# Altium project Woobly.PrjPcb
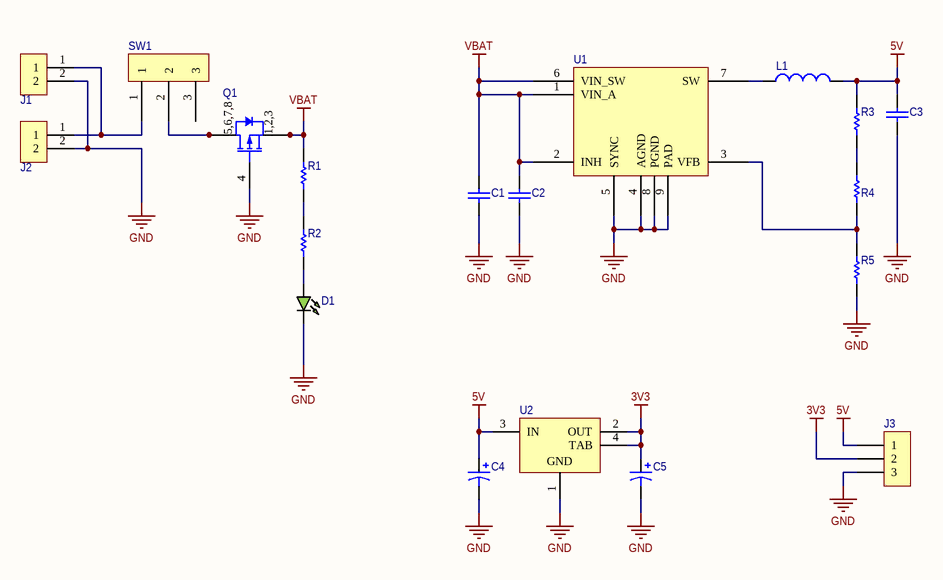
[diagram p0: Power regulators.SchDoc]
3 sheets, 82 parts. Net scope: flat (ports and power ports of the same name join across sheets).
Sheets:
  Power regulators.SchDoc
  Microcontroller and UI.SchDoc
  Peripherals connectors.SchDoc

## Sheet Power regulators.SchDoc
size A; SheetNumber: 1

### Parts
C1  Kemet C1206C475K3RACAUTO  [CAPC3216X180X50ML20T25]  (value not drawn)
C2  Kemet C1206C104K5RACAUTO  [CAPC3216X88X50ML20T25]  (value not drawn)
C3  Kemet C1210C226K4PAC7800  [CAPC3225X205X50ML20T25]  (value not drawn)
C4  Cap Pol2  [PCB-2utroa4rb2vd9is4ckmk-1]  (value not drawn)
C5  Cap Pol2  [PCB-2utroa4rb2vd9is4ckmk-1]  (value not drawn)
D1  LTST-C170KGKT  [CHIPLED  0805]  (value not drawn)
J1  TE   647676-2  [PCB-kypnbpwjlxn1m6lvhwgg-1]  (value not drawn)
J2  TE   647676-2  [PCB-kypnbpwjlxn1m6lvhwgg-1]  (value not drawn)
J3  Molex 75757-0431  [Molex 75757-0431]  (value not drawn)
L1  RLF7030T-3R3M4R1  [INDC7922X32N]  (value not drawn)
Q1  SYM-000bc976ee97dfcc-1  [PCB-o8kpmntap7p5mqdjohts-1]  (value not drawn)
R1  Vishay Dale CRCW12061K00FKEB  [RESC3216X60X45ML10T20]  (value not drawn)
R2  Vishay Dale CRCW12061K00FKEB  [RESC3216X60X45ML10T20]  (value not drawn)
R3  Vishay CRCW1206100KFKEA  [PCB-76kjjvsvnrmyxpejc0rn-1]  (value not drawn)
R4  Vishay Dale CRCW12065K10FKEA  [RESC3216X60X45ML10T20]  (value not drawn)
R5  Vishay Dale CRCW120620K0FKTA  [RESC3216X60X45ML10T20]  (value not drawn)
SW1  Canal Components SL19-121  [PCB-btjqrve0936pn890qe86-1]  (value not drawn)
U1  ST1S10  [PCB-q7tc9tlrfg8r6x64pd1q-1]  (value not drawn)
U2  LM1117IMPX-3.3/NOPB  [MP04A_N]  (value not drawn)

### Nets
3V3: C5.1 J3.2 U2.2(OUT) U2.4(TAB)
5V: C3.1 C4.1 J3.1 L1.2 R3.2 U2.3(IN)
GND: C1.2 C2.2 C3.2 C4.2 C5.2 D1.1(K) J1.2 J2.2 J3.3 Q1.4(G) R5.2 U1.4(AGND) U1.5(SYNC) U1.8(PGND) U1.9(PAD) U2.1(GND)
VBAT: C1.1 C2.1 Q1.1(S) Q1.2(S) Q1.3(S) R1.1 U1.1(VIN_A) U1.2(INH) U1.6(VIN_SW)
NetD1_2: D1.2(A) R2.2
NetJ1_1: J1.1 J2.1 SW1.1
NetL1_1: L1.1 U1.7(SW)
NetQ1_5: Q1.5(D) Q1.6(D) Q1.7(D) Q1.8(D) SW1.2
NetR1_2: R1.2 R2.1
NetR3_1: R3.1 R4.2
NetR4_1: R4.1 R5.1 U1.3(VFB)

Not connected (* = marked no-connect by the designer): SW1 3

### Notes on the sheet
- (in symbol FDS4141) 5,6,7,8; 1,2,3

### Library data of the parts
C1 = C1206C475K3RACAUTO: CAPACITOR, 1206, X7R, 25V, 4.7UF; Capacitance: 4.7e-06 F; Capacitance Tolerance: ±10%; Dielectric Material: Ceramic; Lead-Free Status: R; Voltage Rating (DC): 25.0 V; Case/Package: 1206; Dielectric Characteristic: X7R; Mounting Style: Surface Mount; Octopart Url: https://octopart.com/c1206c475k3racauto-kemet-17603066; OctopartID: 7b3fb339c7a3a4f8; Packaging: Cut Tape (CT); REACH SVHC Compliance: No SVHC; RoHS: Compliant; Manufacturer Part Number: C1206C475K3RACAUTO
C2 = C1206C104K5RACAUTO: Cap Ceramic 0.1uF 50V X7R 10% SMD 1206 125C Plastic T/R; Capacitance: 1e-07 F; Lead-Free Status: R; Voltage Rating (DC): 50.0 V; Manufacturer Part Number: C1206C104K5RACAUTO; Capacitance Tolerance: ±10%; Case/Package: 1206; Dielectric Characteristic: X7R; Dielectric Material: Ceramic; Mounting Style: Surface Mount; Octopart Url: https://octopart.com/c1206c104k5racauto-kemet-12595586; OctopartID: 2beee2243f0af429; Packaging: Cut Tape (CT); REACH SVHC Compliance: No SVHC; RoHS: Compliant
C3 = C1210C226K4PACTU: Capacitor 1210 22uF 16V; Capacitance: 2.2e-05 F; Capacitance Tolerance: ±10%; Dielectric Characteristic: X5R; Dielectric Material: Ceramic; Lead-Free Status: Lead Free; Voltage Rating (DC): 16.0 V; Manufacturer Part Number: C1210C226K4PACTU; Case/Package: 1210; Mounting Style: Surface Mount; Octopart Url: https://octopart.com/c1210c226k4pac7800-kemet-11809228; OctopartID: aef0674eba5a7137; RoHS: Compliant
C4 C5 = T491C106K016AT4153: Cap Tant 10UF 10% 16V 2312
D1 = LTST-C170KGKT: Green 2 x 1.25 x 1.1 mm 130° Water Clear 35 mcd 2 V Surface Mount LED; Manufacturer: Lite-On; Case/Package (SI): 2012; Forward Voltage: 2.00 V; Lead-Free Status: Lead Free; Luminous Intensity: 35.0 mcd; Case/Package: 0805; Viewing Angle: 130 °; OctopartID: 4cca85c80a58930d; Manufacturer Part Number: LTST-C170KGKT; Size-Length: 2.00 mm; Size-Width: 1.25 mm; Octopart URL: https://octopart.com/ltst-c170kgkt-lite-on-549876
J1 J2 = 15EDGRC-3.5-02P-14: Pluggable terminal block; Colour: green; Mat: PA66; on PCBs; male; Contact Plating: Tin; Orientation: Right Angle; Manufacturer Part Number: 15EDGRC-3.5-02P-14; Flammability Rating: UL 94 V-0; Contact Material: Brass
J3 = CMP-6ec4a6b2c126b103-1: Conn Unshrouded Header HDR 3 POS 3.5mm Solder ST Thru-Hole Tube; Current Rating: 16.0 A; Glow Wire Compliant: Non-Compliant; Number of Circuits: 3; Mounting Style: Through Hole; Orientation: Vertical; Octopart URL: http://octopart.com/75757-0431-molex-24939140; Lifecycle Status: Active; Halogen Free Status: Low Halogen; OctopartID: 6ec4a6b2c126b103
L1 = RLF7030T-3R3M4R1: Inductor Power Shielded Wirewound 3.3uH 20% 100KHz Ferrite 4.1A 20.88mOhm DCR T/R; Inductance: 3.30 µH; Manufacturer Part Number: RLF7030T-3R3M4R1; Packaging: Tape & Reel (TR), Cut Tape (CT); Size-Width: 6.80 mm; Size-Length: 7.30 mm
Q1 = FDS4141: P-Channel 40 V 13 mOhm SMT PowerTrench® Mosfet - SOIC-8; Manufacturer Part Number: FDS4141
R1 R2 = CRCW12061K00FKEB: Thick Film Resistors - SMD 1/4watt 1Kohms 1%; Lead-Free Status: Lead Free; Power Rating: 0.25 W; Resistance: 1000.0 Ω; Voltage Rating (DC): 200.0 V; Case/Package: 1206; Number of Pins: 2; Octopart Url: https://octopart.com/crcw12061k00fkeb-vishay+dale-42466336; OctopartID: 6554aed9bc12ba93; Resistance Tolerance: ±1%; RoHS: Compliant; Manufacturer Part Number: CRCW12061K00FKEB
R3 = CRCW1206100KFKEA: Res Thick Film 1206 100K Ohm 1% 1/4W ±100ppm/°C Molded SMD SMD Paper T/R
R4 = CRCW12065K10FKEA: RES SMD 5.1K OHM 1% 1/4W 1206; Case/Package (SI): 3216; Lead-Free Status: Lead Free; Power Rating: 0.25 W; Resistance: 5100.0 Ω; Voltage Rating (DC): 200.0 V; Manufacturer Part Number: CRCW12065K10FKEA; Case/Package: 1206; Mounting Style: Surface Mount; Number of Pins: 2; Octopart Url: https://octopart.com/crcw12065k10fkea-vishay-39999519; OctopartID: afbf64d7d2c67078; REACH SVHC Compliance: No SVHC; Resistance Tolerance: ±1%; RoHS: Compliant; Size-Height: 0.00055 m; Size-Length: 0.0032 m; Size-Width: 0.0016 m
R5 = CRCW120620K0FKTA: RES SMD 20K OHM 1% 1/4W 1206; Case/Package (SI): 3216; Lead-Free Status: Contains Lead; Power Dissipation: 0.25 W; Resistance: 20000.0 Ω; Temperature Coefficient: 100.0 ppm/°C; Voltage Rating (DC): 200.0 V; Manufacturer Part Number: CRCW120620K0FKTA; Case/Package: 1206; Mounting Style: Surface Mount; Number of Pins: 2; Octopart Url: https://octopart.com/crcw120620k0fkta-vishay-46635441; OctopartID: d4d21f1f68050b15; Power Rating: 0.25 W; Resistance Tolerance: ±1%; RoHS: Non-Compliant; Size-Height: 0.00055 m; Size-Length: 0.0032 m; Size-Width: 0.0016 m
SW1 = SL19-121: Switch: slide; Positions: 2; SPDT; 3A/250VAC; 6A/28VDC; ON-ON; OctopartID: 2d08e78b94a7f2cf; Contact Plating: Silver; Octopart URL: http://octopart.com/sl19-121-canal+components-59350217; Contact Material: Copper; Mounting Style: Through Hole; Manufacturer Part Number: SL19-121
U1 = ST1S10PHR: ld1086dt33tr for waterspectr; Lead-Free Status: Lead Free; Output Current: 3.00 A; Packaging: Tape & Reel (TR), Cut Tape (CT); Mounting Style: Surface Mount; Manufacturer Part Number: ST1S10PHR; OctopartID: 3562fcc938a8eaa5; REACH SVHC Compliance: No SVHC; Lifecycle Status: Active; Operating Temperature: 125 °C (max)
U2 = LM1117IMPX-3.3/NOPB: 800mA Low-Dropout Linear Regulator, 4-pin SOT-223, Pb-Free; Dropout Voltage: 1.2 V; Lead-Free Status: Lead Free; Number of Regulated Outputs: 1; Output Capacitor Type: Tantalum; Output Current: 0.8 A; Output Voltage: 3.3 V; Quiescent Current: 0.005 A; Manufacturer Part Number: LM1117IMPX-3.3/NOPB; Lifecycle Status: Active; Number of Pins: 4; Octopart Url: https://octopart.com/lm1117impx-3.3%2Fnopb-texas+instruments-24812442; OctopartID: 57eb9f9be917882c; Packaging: Tape & Reel (TR); REACH SVHC Compliance: No SVHC; RoHS: Compliant

## Sheet Microcontroller and UI.SchDoc
size A4; SheetNumber: 2
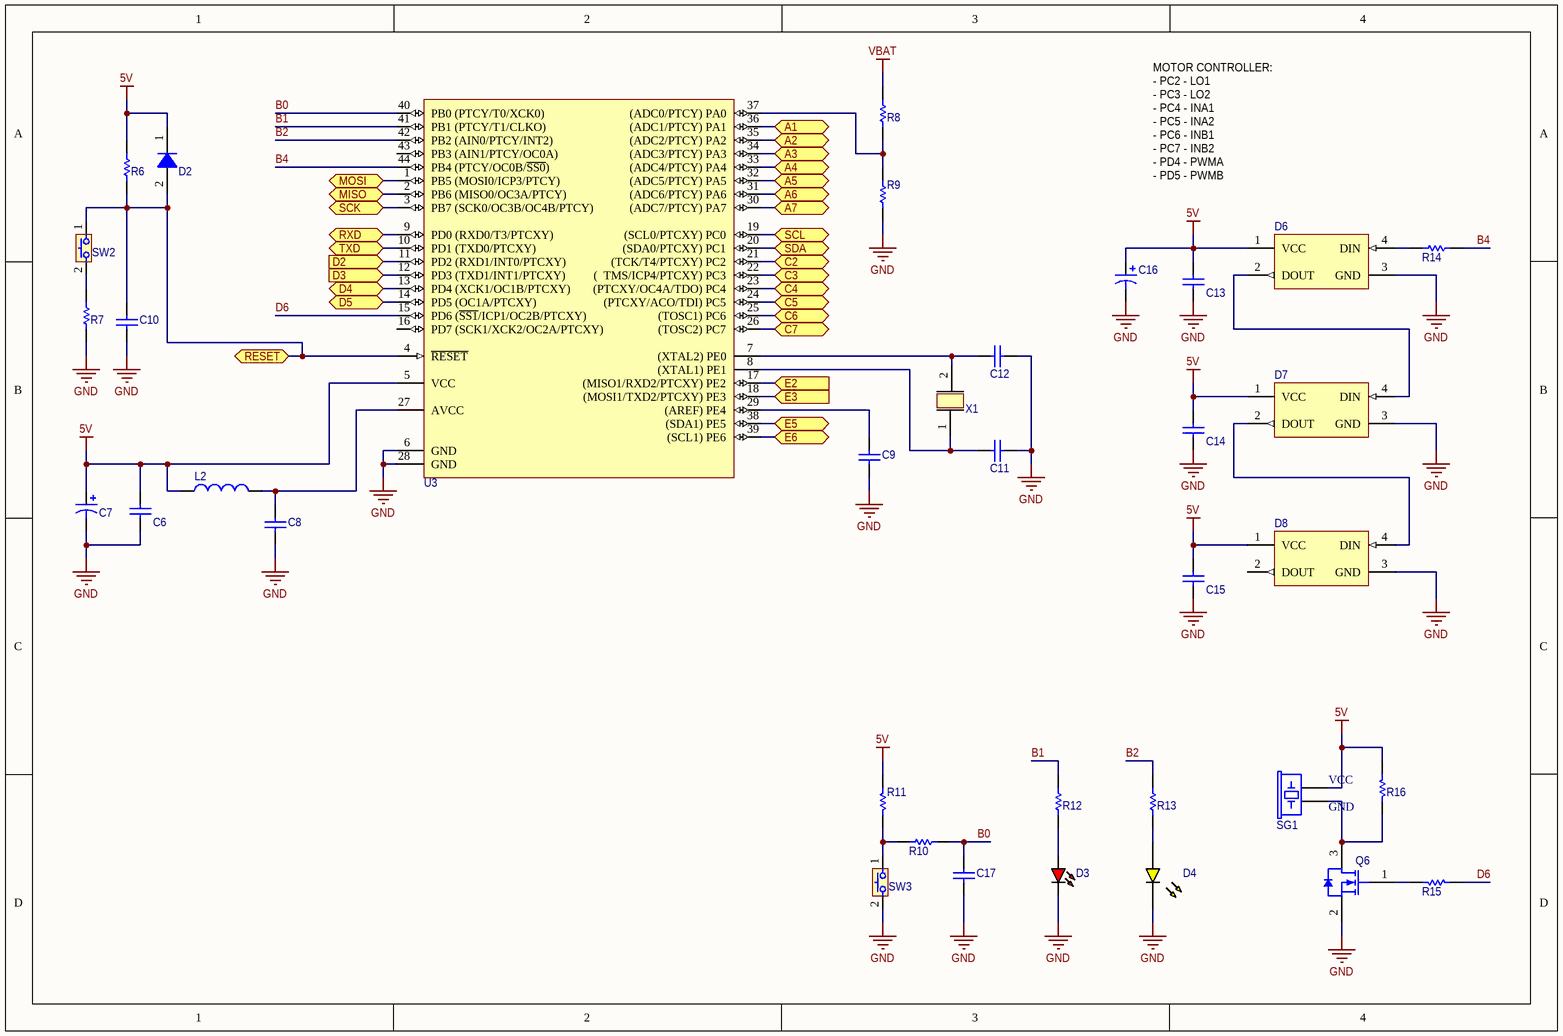
[diagram p1: Microcontroller and UI.SchDoc]

### Parts
C6  Kemet C1206C104K5RACAUTO  [CAPC3216X88X50ML20T25]  (value not drawn)
C7  Cap Pol2  [PCB-2utroa4rb2vd9is4ckmk-1]  (value not drawn)
C8  Kemet C1206C104K5RACAUTO  [CAPC3216X88X50ML20T25]  (value not drawn)
C9  Kemet C1206C104K5RACAUTO  [CAPC3216X88X50ML20T25]  (value not drawn)
C10  Kemet C1206C104K5RACAUTO  [CAPC3216X88X50ML20T25]  (value not drawn)
C11  Kemet C1206C220K5GACTU  [CAPC3216X88X50LL20T25]  (value not drawn)
C12  Kemet C1206C220K5GACTU  [CAPC3216X88X50LL20T25]  (value not drawn)
C13  Kemet C1206C104K5RACAUTO  [CAPC3216X88X50ML20T25]  (value not drawn)
C14  Kemet C1206C104K5RACAUTO  [CAPC3216X88X50ML20T25]  (value not drawn)
C15  Kemet C1206C104K5RACAUTO  [CAPC3216X88X50ML20T25]  (value not drawn)
C16  Panasonic EEEFK1C101P  [PCB-bxqn8ynar2jwyklg28q2-1]  (value not drawn)
C17  Kemet C1206C104K5RACAUTO  [CAPC3216X88X50ML20T25]  (value not drawn)
D2  Fairchild Semiconductor FDLL4148  [LL-34_AP455]  (value not drawn)
D3  Lite-On LTST-C170KRKT  [PCB-7utjwvdtdw1v8scx5ylt-1]  (value not drawn)
D4  Lite-On LTST-C170KSKT  [PCB-3srso9uc5heegaq4ztu4-1]  (value not drawn)
D6  TE-1981584-1  [PCB-20395447-2]  (value not drawn)
D7  TE-1981584-1  [PCB-20395447-2]  (value not drawn)
D8  TE-1981584-1  [PCB-20395447-2]  (value not drawn)
L2  Bourns CM453232-100KL  [PCB-sj0d1m6kkfqzu57ryeks-1]  (value not drawn)
Q6  SYM-ec4d21f6be82338a-2  [PCB-fnvh88uh0gwuonmuoobt-1]  (value not drawn)
R6  Vishay CRCW12064K70FKEA  [1206]  (value not drawn)
R7  Vishay CRCW1206330RFKEA  [PCB-iffx3kyo1buszuhrbsyd-1]  (value not drawn)
R8  Vishay CRCW12064K70FKEA  [1206]  (value not drawn)
R9  Vishay Dale CRCW12067K50FKTA  [RESC3216X60X45ML10T20]  (value not drawn)
R10  Vishay Dale CRCW12061K00FKEB  [RESC3216X60X45ML10T20]  (value not drawn)
R11  Res1  [PCB-r93x9swl7vzrlon1kcic-1]  (value not drawn)
R12  Vishay Dale CRCW12061K00FKEB  [RESC3216X60X45ML10T20]  (value not drawn)
R13  Vishay Dale CRCW12061K00FKEB  [RESC3216X60X45ML10T20]  (value not drawn)
R14  Vishay CRCW1206330RFKEA  [PCB-iffx3kyo1buszuhrbsyd-1]  (value not drawn)
R15  Res1  [PCB-r93x9swl7vzrlon1kcic-1]  (value not drawn)
R16  Res1  [PCB-r93x9swl7vzrlon1kcic-1]  (value not drawn)
SG1  SYM-4a3d82e3cb5995fa-1  [PCB-8mby96szrz0u2nyklaj3-1]  (value not drawn)
SW2  KMR231NGLFS  [PCB-073utuz7vwed4h5iqcvq-1]  (value not drawn)
SW3  KMR231NGLFS  [PCB-073utuz7vwed4h5iqcvq-1]  (value not drawn)
U3  SYM-89d944712a27561e-1  [PCB-mnk8bms7mnnc6ivbcvvg-1]  (value not drawn)
X1  Multicomp HC49S-16-30-50-70-30-ATF  [PCB-g1xa0dtupmw0r2hsib2r-1]  (value not drawn)

### Ports
A1, A2, A3, A4, A5, A6, A7, C2, C3, C4, C5, C6, C7, D2 (in), D3 (in), D4, D5, E2 (in), E3 (in), E5, E6, MISO, MOSI, RESET, RXD, SCK, SCL, SDA, TXD

### Nets
5V: C6.2 C7.1 C13.1 C14.1 C15.1 C16.1 D2.1(CATHODE) D6.1(VCC) D7.1(VCC) D8.1(VCC) L2.1 R6.1 R11.1 R16.2 SG1.0(+) U3.5(VCC)
GND: C6.1 C7.2 C8.1 C9.1 C10.1 C11.1 C12.1 C13.2 C14.2 C15.2 C16.2 C17.1 D3.2(K) D4.2(K) D6.3(GND) D7.3(GND) D8.3(GND) Q6.2(S) R7.2 R9.2 SW3.2 U3.6(GND) U3.28(GND)
VBAT: R8.2
B0: C17.2 R10.2 U3.40(PB0_(PTCY/T0/XCK0))
B1: R12.2 U3.41(PB1_(PTCY/T1/CLKO))
B2: R13.2 U3.42(PB2_(AIN0/PTCY/INT2))
B4: R14.1 U3.44(PB4_(PTCY/OC0B/~{SS0}))
D6: R15.2 U3.15(PD6_(~{SS1}/ICP1/OC2B/PTCXY))
NetC8_2: C8.2 L2.2 U3.27(AVCC)
NetC9_2: C9.2 U3.29((AREF)_PE4)
NetC10_2: C10.2 D2.2(ANODE) R6.2 SW2.1 U3.4(~{RESET}) ; port RESET
NetC11_2: C11.2 U3.8((XTAL1)_PE1) X1.1
NetC12_2: C12.2 U3.7((XTAL2)_PE0) X1.2
NetD3_1: D3.1(A) R12.1
NetD4_1: D4.1(A) R13.1
NetD6_2: D6.2(DOUT) D7.4(DIN)
NetD6_4: D6.4(DIN) R14.2
NetD7_2: D7.2(DOUT) D8.4(DIN)
NetJ4_1: U3.2(PB6_(MISO0/OC3A/PTCY)) ; port MISO
NetJ4_3: U3.3(PB7_(SCK0/OC3B/OC4B/PTCY)) ; port SCK
NetJ4_4: U3.1(PB5_(MOSI0/ICP3/PTCY)) ; port MOSI
NetJ5_1: U3.23((PTCXY/OC4A/TDO)_PC4) ; port C4
NetJ5_2: U3.24((PTCXY/ACO/TDI)_PC5) ; port C5
NetJ5_3: U3.13(PD4_(XCK1/OC1B/PTCXY)) ; port D4
NetJ5_4: U3.25((TOSC1)_PC6) ; port C6
NetJ5_5: U3.26((TOSC2)_PC7) ; port C7
NetJ5_6: U3.14(PD5_(OC1A/PTCXY)) ; port D5
NetJ5_7: U3.21((TCK/T4/PTCXY)_PC2) ; port C2
NetJ5_8: U3.22((__TMS/ICP4/PTCXY)_PC3) ; port C3
NetJ6_3: U3.17((MISO1/RXD2/PTCXY)_PE2) ; port E2
NetJ7_3: U3.18((MOSI1/TXD2/PTCXY)_PE3) ; port E3
NetJ11_4: U3.36((ADC1/PTCY)_PA1) ; port A1
NetJ11_5: U3.35((ADC2/PTCY)_PA2) ; port A2
NetJ11_6: U3.34((ADC3/PTCY)_PA3) ; port A3
NetJ11_7: U3.33((ADC4/PTCY)_PA4) ; port A4
NetJ11_8: U3.32((ADC5/PTCY)_PA5) ; port A5
NetJ11_9: U3.31((ADC6/PTCY)_PA6) ; port A6
NetJ11_10: U3.30((ADC7/PTCY)_PA7) ; port A7
NetJ12_2: U3.38((SDA1)_PE5) ; port E5
NetJ12_3: U3.39((SCL1)_PE6) ; port E6
NetQ2_3: U3.20((SDA0/PTCXY)_PC1) ; port SDA
NetQ3_3: U3.19((SCL0/PTCXY)_PC0) ; port SCL
NetQ4_3: U3.9(PD0_(RXD0/T3/PTCXY)) ; port RXD
NetQ5_3: U3.10(PD1_(TXD0/PTCXY)) ; port TXD
NetQ6_1: Q6.1(G) R15.1
NetQ6_3: Q6.3(D) R16.1 SG1.1(-)
NetR7_1: R7.1 SW2.2
NetR8_1: R8.1 R9.1 U3.37((ADC0/PTCY)_PA0)
NetR10_1: R10.1 R11.2 SW3.1
NetU3_11: U3.11(PD2_(RXD1/INT0/PTCXY)) ; port D2
NetU3_12: U3.12(PD3_(TXD1/INT1/PTCXY)) ; port D3

Not connected (* = marked no-connect by the designer): D8 2(DOUT); U3 16(PD7_(SCK1/XCK2/OC2A/PTCXY)) 43(PB3_(AIN1/PTCY/OC0A))

### Notes on the sheet
- MOTOR CONTROLLER:
  - PC2 - LO1
  - PC3 - LO2
  - PC4 - INA1
  - PC5 - INA2
  - PC6 - INB1
  - PC7 - INB2
  - PD4 - PWMA
  - PD5 - PWMB
- (in symbol BPT14X) VCC; GND

### Library data of the parts
C6 = C1206C104K5RACAUTO: as C2 on sheet Power regulators; Manufacturer Part Number: C1206C104K5RACAUTO; Capacitance Tolerance: ±10%; Case/Package: 1206; Dielectric Characteristic: X7R; Dielectric Material: Ceramic; Mounting Style: Surface Mount; Octopart Url: https://octopart.com/c1206c104k5racauto-kemet-12595586; OctopartID: 2beee2243f0af429; Packaging: Cut Tape (CT); REACH SVHC Compliance: No SVHC; RoHS: Compliant
C7 = T491C106K016AT4153: Cap Tant 10UF 10% 16V 2312
C8-C10 C13-C15 C17 = CMP-3062694-2: Cap Ceramic 0.1uF 50V X7R 10% SMD 1206 125C Plastic T/R; Capacitance: 1e-07 F; Lead-Free Status: R; Voltage Rating (DC): 50.0 V; Manufacturer Part Number: C1206C104K5RACAUTO; Capacitance Tolerance: ±10%; Case/Package: 1206; Dielectric Characteristic: X7R; Dielectric Material: Ceramic; Mounting Style: Surface Mount; Octopart Url: https://octopart.com/c1206c104k5racauto-kemet-12595586; OctopartID: 2beee2243f0af429; Packaging: Cut Tape (CT); REACH SVHC Compliance: No SVHC; RoHS: Compliant
C11 C12 = C1206C220K5GACTU: Capacitance: 2.2e-11 F; Capacitance Tolerance: ±10%; Dielectric Characteristic: C0G/NP0; Dielectric Material: Ceramic; Lead-Free Status: Lead Free; Voltage Rating (DC): 50.0 V; Manufacturer Part Number: C1206C220K5GACTU; Case/Package: 1206; Mounting Style: Surface Mount; Octopart Url: https://octopart.com/c1206c220k5gactu-kemet-4496258; OctopartID: ab38627615dc74ff; Packaging: Cut Tape (CT); RoHS: Compliant
C16 = EEEFK1C101P: Cap Aluminum Lytic 100uF 16V 20% (6.3 X 5.8mm) SMD 240mA 2000h 105°C Automotive T/R; Voltage Rating (DC): 16.0 V; Lead-Free Status: Lead Free; Dielectric Material: Aluminum Electrolytic; Capacitance: 0.0001 F; Size-Height: 0.0058 m; REACH SVHC Compliance: No SVHC; OctopartID: 6d97a4db90fcb250; Size-Diameter: 0.0063 m; Capacitance Tolerance: ±20%; Size-Width: 0.0078 m; Mounting Style: Surface Mount; Size-Length: 0.0058 m; Number of Pins: 2; Manufacturer Part Number: EEEFK1C101P; Packaging: Cut Tape (CT), Reel; Lifecycle Status: Not Listed by Manufacturer; RoHS: Compliant; Octopart URL: http://octopart.com/eeefk1c101p-panasonic-4642829
D2 = FDLL4148: Fairchild; Voltage Rating (DC): 100.0 V; Current Rating: 0.2 A; Polarity: Standard; Capacitance: 4e-12 F; Forward Voltage: 1.0 V; Lead-Free Status: Lead Free; Mounting Style: Surface Mount; REACH SVHC Compliance: No SVHC; Lifecycle Status: Active; OctopartID: b1e678e9918d6e21; RoHS: Compliant; Number of Pins: 2; Octopart Url: http://octopart.com/fdll4148-fairchild+semiconductor-328973; Manufacturer Part Number: FDLL4148; Seller Landing  Url: https://octopart-clicks.com/click/track?country=US&ak=8157f166&sig=011a551&sid=5489&ppid=328973&vpid=20232990&ct=offers
D3 = LTST-C170KRKT: Red 2 x 1.25 x 1.1 mm 130° Water Clear 54 mcd 2 V LED Surface Mount; Lens Type: Non-Diffused; Case/Package (SI): 2012; Luminous Intensity: 54.0 mcd; Lead-Free Status: Lead Free; Wavelength: 639 nm; Forward Voltage: 2.00 V; Mounting Style: Surface Mount, Vertical; Color: Red; Octopart URL: https://octopart.com/ltst-c170krkt-lite-on-549878; Manufacturer Part Number: LTST-C170KRKT; RoHS: Compliant; Size-Height: 1.10 mm; Size-Length: 2.00 mm; Case/Package: 0805; OctopartID: 1d24d4265bb4c2e3; Viewing Angle: 130 °; Size-Width: 1.25 mm; Operating Temperature: 85.0 °C (max)
D4 = LTST-C170KSKT: Yellow 2 x 1.25 x 1.1 mm 130° Water Clear 112 mcd 1.8 V LED Surface Mount; Forward Voltage: 2.00 V
D6-D8 = WS2812B: INTELLIGENT CONTROL LED without centered Pad; OctopartID: be34745cee7461f3
L2 = CM453232-100KL: Inductor General Purpose Chip Wirewound 10uH 10% 2.52MHz 50Q-Factor Ferrite 250mA 1.6Ohm DCR 1812 T/R; Case/Package (SI): 4532; Resonant Frequency: 20.0 MHz; Inductance: 10.0 µH; Resistance: 1.60 Ω; Q-Factor: 50.0; Mounting Style: Surface Mount; Manufacturer Part Number: CM453232-100KL; Current Rating: 250 mA; Packaging: Cut Tape (CT); Number of Pins: 2; REACH SVHC Compliance: No SVHC; Case/Package: 1812; Self Resonant Frequency: 20.0 MHz; RoHS: Compliant; OctopartID: f812311a91b727d5; Octopart URL: http://octopart.com/cm453232-100kl-bourns-150723
Q6 = BSS138P,215: Transistor Polarity: n Channel; Drain Source Voltage Vds: 60V; Continuous Drain Current Id: 360Ma; On Resistance...; Lead-Free Status: Lead Free; Mounting Style: Surface Mount; Lifecycle Status: Active; Operating Temperature: -55.0 °C to 150 °C; RoHS: Compliant; OctopartID: ec4d21f6be82338a; Manufacturer Part Number: BSS138P,215; Number of Pins: 3
R6 R8 = CRCW12064K70FKEA: RES SMD 4.7K OHM 1% 1/4W 1206; Case/Package (SI): 3216; Lead-Free Status: Lead Free; Power Rating: 0.25 W; Resistance: 4700.0 Ω; Voltage Rating (DC): 200.0 V; Case/Package: 1206; Mounting Style: Surface Mount; Number of Pins: 2; Octopart Url: https://octopart.com/crcw12064k70fkea-vishay-39455584; OctopartID: 3f78f428117ee0bf; REACH SVHC Compliance: No SVHC; Resistance Tolerance: ±1%; RoHS: Compliant; Size-Height: 0.00055 m; Size-Length: 0.0032 m; Size-Width: 0.0016 m; Manufacturer Part Number: CRCW12064K70FKEA
R7 R14 = CRCW1206330RFKEA: Res RES SMD 330 OHM 1% 1/4W 1206; RoHS: Compliant
R9 = CRCW12067K50FKTA: RES SMD 7.5K OHM 1% 1/4W 1206; Case/Package (SI): 3216; Lead-Free Status: Contains Lead; Power Dissipation: 0.25 W; Resistance: 7500.0 Ω; Temperature Coefficient: 100.0 ppm/°C; Voltage Rating (DC): 200.0 V; Manufacturer Part Number: CRCW12067K50FKTA; Case/Package: 1206; Mounting Style: Surface Mount; Octopart Url: https://octopart.com/crcw12067k50fkta-vishay-39410547; OctopartID: b2ac79ffccb96d6b; Power Rating: 0.25 W; Resistance Tolerance: ±1%; RoHS: Non-Compliant; Size-Height: 0.00055 m; Size-Length: 0.0032 m; Size-Width: 0.0016 m
R10 R12 R13 = CRCW12061K00FKEB: as R1 on sheet Power regulators; Case/Package: 1206; Number of Pins: 2; Octopart Url: https://octopart.com/crcw12061k00fkeb-vishay+dale-42466336; OctopartID: 6554aed9bc12ba93; Resistance Tolerance: ±1%; RoHS: Compliant; Manufacturer Part Number: CRCW12061K00FKEB
R11 R15 R16 = CRCW120610K0FKTA: Res Thick Film 1206 10K Ohm 1% 1/4W ±100ppm/°C Molded SMD SMD Paper T/R; Resistance: 10.0 kΩ; Temperature Coefficient: -100 ppm/°C to 100 ppm/°C; Octopart URL: https://octopart.com/crcw120610k0fkta-vishay-40299249; Number of Pins: 2; Manufacturer Part Number: CRCW120610K0FKTA
SG1 = BPT14X: Sound transducer: piezo alarm; with built-in generator; THT
SW2 SW3 = KMR231NGLFS: Switch Tactile N.O. SPST Button Gull Wing 0.05A 32VDC 1VA 150000Cycles 3N SMD Automotive T/R
U3 = CMP-89d944712a27561e-1: AVR microcontroller; EEPROM: 1kB; SRAM: 2kB; Flash: 32kB; TQFP44; Lead-Free Status: Lead Free; Case/Package: TQFP; RoHS: Compliant; Mounting Style: Surface Mount; Lifecycle Status: Not Listed by Manufacturer; OctopartID: 89d944712a27561e; Octopart URL: https://octopart.com/atmega324pb-au-microchip-77760152
X1 = CMP-c0ad0924a56a1f6a-3: CRYSTAL, HC-49/S, 16.0MHZ; Ouput Frequency: 16.0MHz; Accuracy: ± 30ppm; Operating Temperature Range: -20°C to +70°C; ...; Load Capacitance: 30.0 pF; Octopart URL: http://octopart.com/hc49s-16-30-50-70-30-atf-multicomp-8601761; OctopartID: c0ad0924a56a1f6a

## Sheet Peripherals connectors.SchDoc
size A; SheetNumber: 3
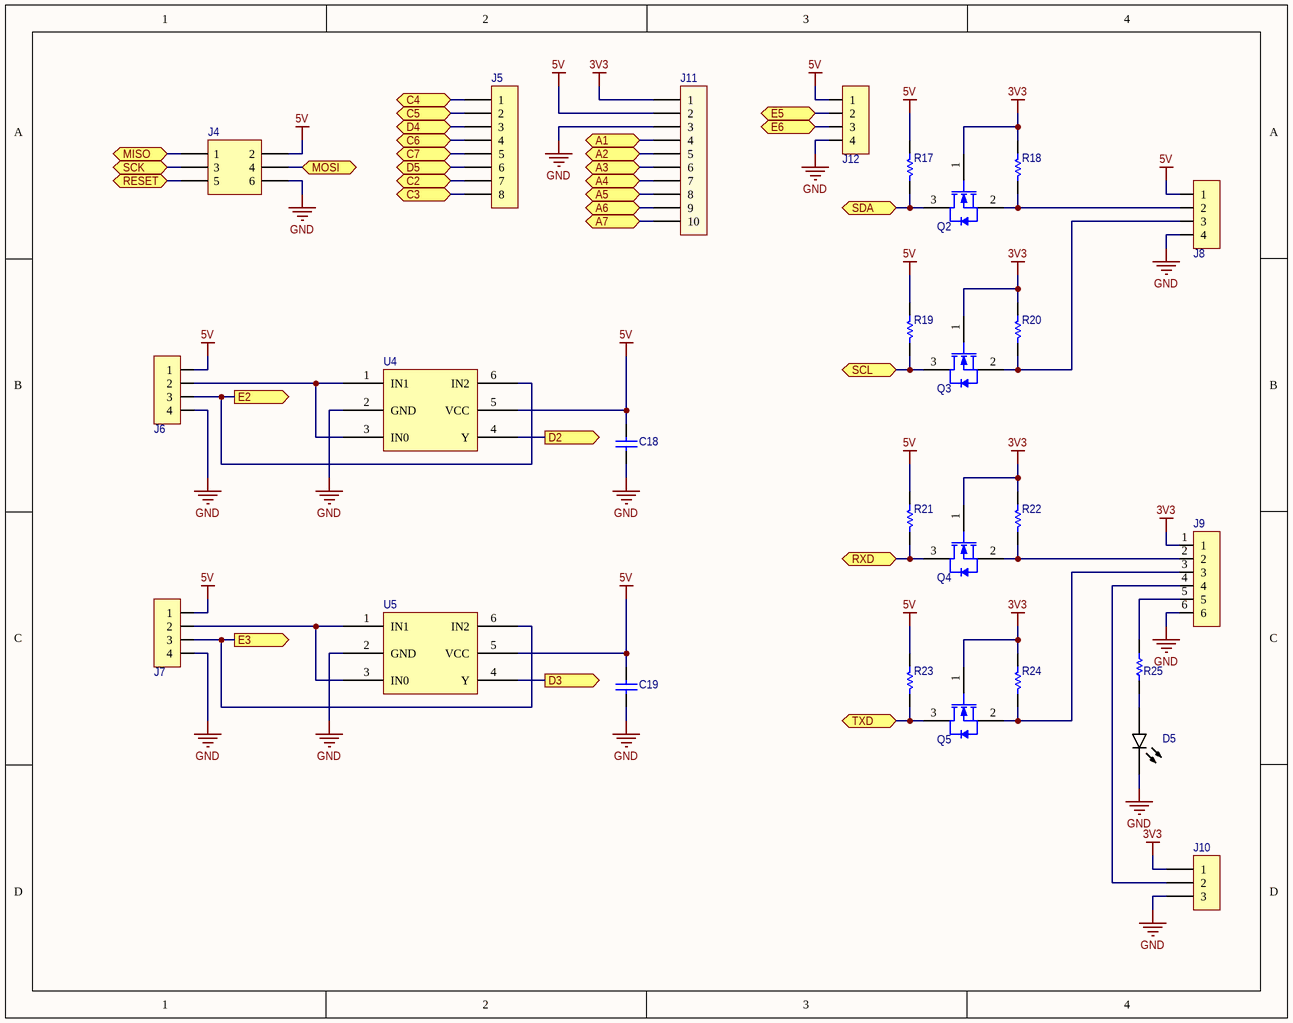
[diagram p2: Peripherals connectors.SchDoc]

### Parts
C18  Kemet C1206C104K5RACAUTO  [CAPC3216X88X50ML20T25]  (value not drawn)
C19  Kemet C1206C104K5RACAUTO  [CAPC3216X88X50ML20T25]  (value not drawn)
D5  Lite-On LTST-C170TBKT  [CHIPLED  0805 BLUE]  (value not drawn)
J4  FCI 67996-206HLF  [PCB-av458rj4t6vupn2hcvqe-1]  (value not drawn)
J5  Samtec MMS-108-01-L-SV  [PCB-goc1bdntoqdy8u4hrzei-1]  (value not drawn)
J6  4pin header  [PCBComponent_1 - duplicate]  (value not drawn)
J7  4pin header  [PCBComponent_1 - duplicate]  (value not drawn)
J8  4pin header  [PCBComponent_1 - duplicate]  (value not drawn)
J9  TE Connectivity / AMP 3-644456-5  [PCB-oudem42uhcimrbfznktg-1]  (value not drawn)
J10  Molex 75757-0431  [Molex 75757-0431]  (value not drawn)
J11  Jameco Valuepro 7000-1X10SG-R  [PCB-pv1vym0ok8u0vunn5wic-1]  (value not drawn)
J12  4pin header  [PCBComponent_1 - duplicate]  (value not drawn)
Q2  SYM-ec4d21f6be82338a-2  [PCB-fnvh88uh0gwuonmuoobt-1]  (value not drawn)
Q3  SYM-ec4d21f6be82338a-2  [PCB-fnvh88uh0gwuonmuoobt-1]  (value not drawn)
Q4  SYM-ec4d21f6be82338a-2  [PCB-fnvh88uh0gwuonmuoobt-1]  (value not drawn)
Q5  SYM-ec4d21f6be82338a-2  [PCB-fnvh88uh0gwuonmuoobt-1]  (value not drawn)
R17  Res1  [PCB-r93x9swl7vzrlon1kcic-1]  (value not drawn)
R18  Res1  [PCB-r93x9swl7vzrlon1kcic-1]  (value not drawn)
R19  Res1  [PCB-r93x9swl7vzrlon1kcic-1]  (value not drawn)
R20  Res1  [PCB-r93x9swl7vzrlon1kcic-1]  (value not drawn)
R21  Res1  [PCB-r93x9swl7vzrlon1kcic-1]  (value not drawn)
R22  Res1  [PCB-r93x9swl7vzrlon1kcic-1]  (value not drawn)
R23  Res1  [PCB-r93x9swl7vzrlon1kcic-1]  (value not drawn)
R24  Res1  [PCB-r93x9swl7vzrlon1kcic-1]  (value not drawn)
R25  Vishay Dale CRCW12061K00FKEB  [RESC3216X60X45ML10T20]  (value not drawn)
U4  Diodes Inc. 74LVC1G58W6-7  [PCB-s3ckst0z292py2klz87t-1]  (value not drawn)
U5  Diodes Inc. 74LVC1G58W6-7  [PCB-s3ckst0z292py2klz87t-1]  (value not drawn)

### Ports
A1, A2, A3, A4, A5, A6, A7, C2, C3, C4, C5, C6, C7, D2 (out), D3 (out), D4, D5, E2 (out), E3 (out), E5, E6, MISO, MOSI, RESET, RXD, SCK, SCL, SDA, TXD

### Nets
3V3: J9.1 J10.1 J11.1 Q2.1(G) Q3.1(G) Q4.1(G) Q5.1(G) R18.1 R20.1 R22.1 R24.1
5V: C18.1 C19.1 J4.2 J6.1 J7.1 J8.1 J11.2 J12.1 R17.1 R19.1 R21.1 R23.1 U4.5(VCC) U5.5(VCC)
GND: C18.2 C19.2 D5.2(K) J4.6 J6.4 J7.4 J8.4 J9.6 J10.3 J11.3 J12.4 U4.2(GND) U5.2(GND)
NetC10_2: J4.5 ; port RESET
NetD5_1: D5.1(A) R25.1
NetJ4_1: J4.1 ; port MISO
NetJ4_3: J4.3 ; port SCK
NetJ4_4: J4.4 ; port MOSI
NetJ5_1: J5.1 ; port C4
NetJ5_2: J5.2 ; port C5
NetJ5_3: J5.3 ; port D4
NetJ5_4: J5.4 ; port C6
NetJ5_5: J5.5 ; port C7
NetJ5_6: J5.6 ; port D5
NetJ5_7: J5.7 ; port C2
NetJ5_8: J5.8 ; port C3
NetJ6_2: J6.2 U4.1(IN1) U4.3(IN0)
NetJ6_3: J6.3 U4.6(IN2) ; port E2
NetJ7_2: J7.2 U5.1(IN1) U5.3(IN0)
NetJ7_3: J7.3 U5.6(IN2) ; port E3
NetJ8_2: J8.2 Q2.2(S) R18.2
NetJ8_3: J8.3 Q3.2(S) R20.2
NetJ9_2: J9.2 Q4.2(S) R22.2
NetJ9_3: J9.3 Q5.2(S) R24.2
NetJ9_4: J9.4 J10.2
NetJ9_5: J9.5 R25.2
NetJ11_4: J11.4 ; port A1
NetJ11_5: J11.5 ; port A2
NetJ11_6: J11.6 ; port A3
NetJ11_7: J11.7 ; port A4
NetJ11_8: J11.8 ; port A5
NetJ11_9: J11.9 ; port A6
NetJ11_10: J11.10 ; port A7
NetJ12_2: J12.2 ; port E5
NetJ12_3: J12.3 ; port E6
NetQ2_3: Q2.3(D) R17.2 ; port SDA
NetQ3_3: Q3.3(D) R19.2 ; port SCL
NetQ4_3: Q4.3(D) R21.2 ; port RXD
NetQ5_3: Q5.3(D) R23.2 ; port TXD
NetU3_11: U4.4(Y) ; port D2
NetU3_12: U5.4(Y) ; port D3

### Library data of the parts
C18 C19 = C1206C104K5RACAUTO: as C2 on sheet Power regulators; Manufacturer Part Number: C1206C104K5RACAUTO; Capacitance Tolerance: ±10%; Case/Package: 1206; Dielectric Characteristic: X7R; Dielectric Material: Ceramic; Mounting Style: Surface Mount; Octopart Url: https://octopart.com/c1206c104k5racauto-kemet-12595586; OctopartID: 2beee2243f0af429; Packaging: Cut Tape (CT); REACH SVHC Compliance: No SVHC; RoHS: Compliant
D5 = LTST-C170TBKT: Blue 2 x 1.25 x 1.1 mm 130° Water Clear 112 mcd 3.8 V LED Surface Mount; Forward Voltage: 3.30 V; Viewing Angle: 130 °; Size-Length: 2.00 mm; Size-Width: 1.25 mm; Color: Blue
J4 = CMP-bc8877e797ed634f-3: Conn Unshrouded Header HDR 6 POS 2.54mm Solder ST Thru-Hole Poly Bag; Number of Contacts: 6; Gender: Male; Contact Plating: Gold; Manufacturer Part Number: 67996-206HLF; RoHS: Compliant; Packaging: Bulk; OctopartID: bc8877e797ed634f; Mounting Style: Through Hole; Octopart URL: http://octopart.com/67996-206hlf-fci-40177155; Contact Material: Phosphor Bronze
J5 = CMP-11ccd8c2bcd6ce0b-2: Conn Socket Strip SKT 8 POS 2mm Solder ST Thru-Hole Tube; Number of Positions: 8; Lead-Free Status: Lead Free; Pin Pitch: 2.00 mm; Gender: Female; Number of Contacts: 8; Size-Width: 2.00 mm; RoHS: Compliant; Packaging: Tube; REACH SVHC Compliance: No SVHC; Mounting Style: Through Hole, Vertical; Contact Material: Phosphor Bronze; Housing Color: Black; Contact Plating: Gold; OctopartID: 11ccd8c2bcd6ce0b; Number of Rows: 1; Size-Height: 4.45 mm; Size-Length: 16.0 mm; Housing Material: Plastic; Manufacturer Part Number: MMS-108-01-L-SV; Octopart URL: http://octopart.com/mms-108-01-l-sv-samtec-297084
J6-J8 J12 = CMP-6785af82bd5db842-5: Conn Unshrouded Header HDR 4 POS 2.54mm Solder ST Thru-Hole C-Grid III™ Tray; Manufacturer Part Number: 0901200124; Gender: Male; Orientation: Straight; RoHS: Compliant; Mounting Style: Solder; Octopart URL: http://octopart.com/0901200124-molex-17694654; Contact Plating: Tin; OctopartID: 6785af82bd5db842
J9 = CMP-7ab1b1e1ad8ca576-9: MTA-100 Series 6 Position 2.54 mm Pitch Single Row Tin Plated Header; Lead-Free Status: Lead Free; Gender: Male; Mounting Angle: 180 °; ELV Compliant: Compliant; Voltage Rating (AC): 250 V; Shrouded: No; Number of Positions: 6; RoHS: Compliant; Housing Color: Natural; Flammability Rating: UL 94 V-0; Lifecycle Status: Active; Size-Width: 2.34 mm; Mounting Style: Through Hole, Vertical; OctopartID: 7ab1b1e1ad8ca576; Orientation: Vertical; Octopart URL: http://octopart.com/3-644456-6-te+connectivity+%2F+amp-39514715; Number of Rows: 1; Housing Material: Polyester; Number of Contacts: 6; Contact Material: Copper Alloy; Contact Plating: Tin
J10 = CMP-6ec4a6b2c126b103-1: as J3 on sheet Power regulators; Mounting Style: Through Hole; Orientation: Vertical; Octopart URL: http://octopart.com/75757-0431-molex-24939140; Lifecycle Status: Active; Halogen Free Status: Low Halogen; OctopartID: 6ec4a6b2c126b103
J11 = CMP-6671af580ca0b9b6-1: Header Straight Male 1 Row 10 Pin
Q2-Q5 = BSS138P,215: as Q6 on sheet Microcontroller and UI; Mounting Style: Surface Mount; Lifecycle Status: Active; Operating Temperature: -55.0 °C to 150 °C; RoHS: Compliant; OctopartID: ec4d21f6be82338a; Manufacturer Part Number: BSS138P,215; Number of Pins: 3
R17-R19 R21-R24 = CRCW120610K0FKTA: as R11 on sheet Microcontroller and UI; Octopart URL: https://octopart.com/crcw120610k0fkta-vishay-40299249; Number of Pins: 2; Manufacturer Part Number: CRCW120610K0FKTA
R20 = CMP-1d37d65bd2a0c2f0-1: Res Thick Film 1206 10K Ohm 1% 1/4W ±100ppm/°C Molded SMD SMD Paper T/R; Manufacturer Part Number: CRCW120610K0FKTA; Resistance: 10.0 kΩ; Temperature Coefficient: -100 ppm/°C to 100 ppm/°C; Octopart URL: https://octopart.com/crcw120610k0fkta-vishay-40299249; Number of Pins: 2
R25 = CRCW12061K00FKEB: as R1 on sheet Power regulators; Case/Package: 1206; Number of Pins: 2; Octopart Url: https://octopart.com/crcw12061k00fkeb-vishay+dale-42466336; OctopartID: 6554aed9bc12ba93; Resistance Tolerance: ±1%; RoHS: Compliant; Manufacturer Part Number: CRCW12061K00FKEB
U4 U5 = 74LVC1G58W6-7: LOGIC, POS MULTI FUNC, 3 IP, SOT26; Logic Type: Configurable Multiple Function; O; Supply Voltage (DC): 1.65 V (min); Lead-Free Status: Lead Free; Number of Gates: 1; Octopart URL: http://octopart.com/74lvc1g58w6-7-diodes+inc.-20104502

## Nets that join several sheets
3V3: Power regulators (C5.1 J3.2 U2.2 U2.4), Peripherals connectors (11 pins)
5V: Power regulators (6 pins), Microcontroller and UI (16 pins), Peripherals connectors (14 pins)
GND: Power regulators (16 pins), Microcontroller and UI (23 pins), Peripherals connectors (13 pins)
VBAT: Power regulators (9 pins), Microcontroller and UI (R8.2)
NetC10_2: Microcontroller and UI (5 pins), Peripherals connectors (J4.5)
NetJ4_1: Microcontroller and UI (U3.2), Peripherals connectors (J4.1)
NetJ4_3: Microcontroller and UI (U3.3), Peripherals connectors (J4.3)
NetJ4_4: Microcontroller and UI (U3.1), Peripherals connectors (J4.4)
NetJ5_1: Microcontroller and UI (U3.23), Peripherals connectors (J5.1)
NetJ5_2: Microcontroller and UI (U3.24), Peripherals connectors (J5.2)
NetJ5_3: Microcontroller and UI (U3.13), Peripherals connectors (J5.3)
NetJ5_4: Microcontroller and UI (U3.25), Peripherals connectors (J5.4)
NetJ5_5: Microcontroller and UI (U3.26), Peripherals connectors (J5.5)
NetJ5_6: Microcontroller and UI (U3.14), Peripherals connectors (J5.6)
NetJ5_7: Microcontroller and UI (U3.21), Peripherals connectors (J5.7)
NetJ5_8: Microcontroller and UI (U3.22), Peripherals connectors (J5.8)
NetJ6_3: Microcontroller and UI (U3.17), Peripherals connectors (J6.3 U4.6)
NetJ7_3: Microcontroller and UI (U3.18), Peripherals connectors (J7.3 U5.6)
NetJ11_4: Microcontroller and UI (U3.36), Peripherals connectors (J11.4)
NetJ11_5: Microcontroller and UI (U3.35), Peripherals connectors (J11.5)
NetJ11_6: Microcontroller and UI (U3.34), Peripherals connectors (J11.6)
NetJ11_7: Microcontroller and UI (U3.33), Peripherals connectors (J11.7)
NetJ11_8: Microcontroller and UI (U3.32), Peripherals connectors (J11.8)
NetJ11_9: Microcontroller and UI (U3.31), Peripherals connectors (J11.9)
NetJ11_10: Microcontroller and UI (U3.30), Peripherals connectors (J11.10)
NetJ12_2: Microcontroller and UI (U3.38), Peripherals connectors (J12.2)
NetJ12_3: Microcontroller and UI (U3.39), Peripherals connectors (J12.3)
NetQ2_3: Microcontroller and UI (U3.20), Peripherals connectors (Q2.3 R17.2)
NetQ3_3: Microcontroller and UI (U3.19), Peripherals connectors (Q3.3 R19.2)
NetQ4_3: Microcontroller and UI (U3.9), Peripherals connectors (Q4.3 R21.2)
NetQ5_3: Microcontroller and UI (U3.10), Peripherals connectors (Q5.3 R23.2)
NetU3_11: Microcontroller and UI (U3.11), Peripherals connectors (U4.4)
NetU3_12: Microcontroller and UI (U3.12), Peripherals connectors (U5.4)